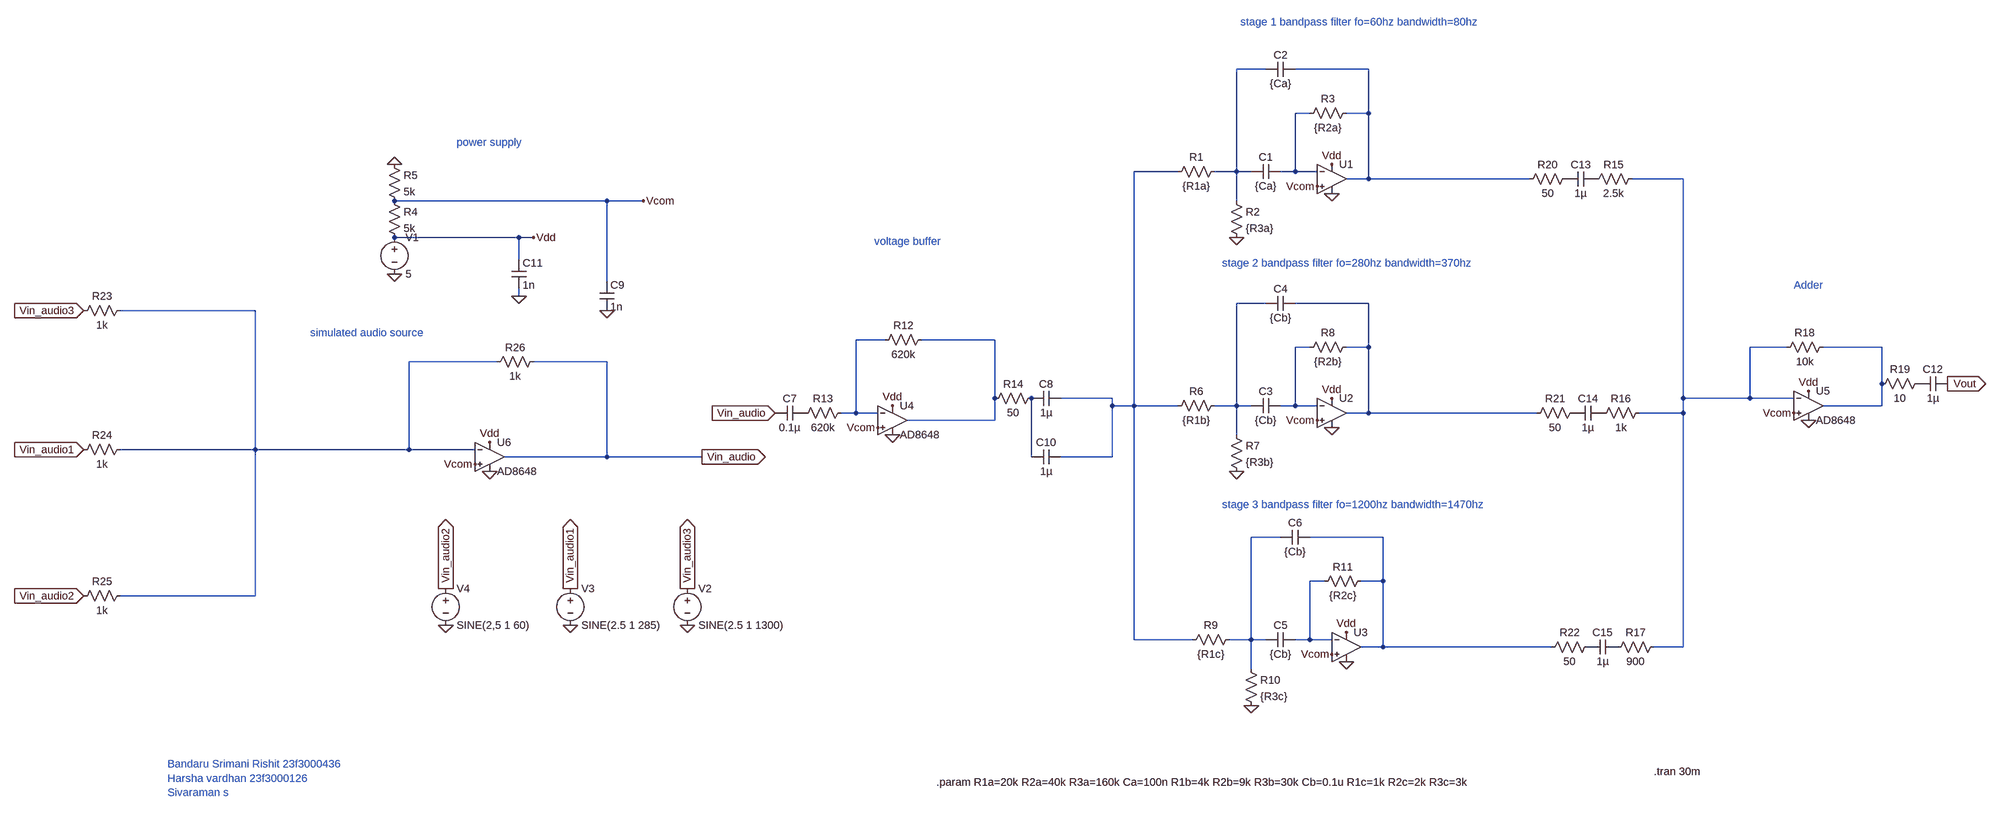
[diagram p0: schematic project_demo.asc]
project_demo.asc, the LTspice schematic file:
Version 4.1
SHEET 1 2216 1440
WIRE 256 -160 192 -160
WIRE 480 -160 320 -160
WIRE 352 -64 320 -64
WIRE 480 -64 480 -160
WIRE 480 -64 432 -64
WIRE 64 64 -32 64
WIRE 192 64 192 -160
WIRE 192 64 144 64
WIRE 224 64 192 64
WIRE 320 64 320 -64
WIRE 320 64 288 64
WIRE 368 64 320 64
WIRE 480 80 480 -64
WIRE 480 80 432 80
WIRE 832 80 480 80
WIRE 1168 80 1056 80
WIRE -1184 128 -1648 128
WIRE -1104 128 -1184 128
WIRE 192 128 192 64
WIRE -1376 208 -1648 208
WIRE -1344 208 -1376 208
WIRE -1376 256 -1376 208
WIRE -1184 304 -1184 128
WIRE -1376 336 -1376 320
WIRE 256 352 192 352
WIRE 480 352 320 352
WIRE -1952 368 -2272 368
WIRE -576 432 -640 432
WIRE -336 432 -496 432
WIRE 352 448 320 448
WIRE 480 448 480 352
WIRE 480 448 432 448
WIRE 1472 448 1392 448
WIRE 1680 448 1552 448
WIRE -1424 480 -1616 480
WIRE -1184 480 -1344 480
WIRE 1680 528 1680 448
WIRE -336 560 -336 432
WIRE -80 560 -192 560
WIRE 1168 560 1168 80
WIRE 1392 560 1392 448
WIRE 1392 560 1168 560
WIRE 1488 560 1392 560
WIRE -80 576 -80 560
WIRE -32 576 -32 64
WIRE -32 576 -80 576
WIRE 64 576 -32 576
WIRE 192 576 192 352
WIRE 192 576 144 576
WIRE 224 576 192 576
WIRE 320 576 320 448
WIRE 320 576 288 576
WIRE 368 576 320 576
WIRE 1680 576 1680 528
WIRE 1680 576 1552 576
WIRE -640 592 -640 432
WIRE -640 592 -672 592
WIRE -592 592 -640 592
WIRE 480 592 480 448
WIRE 480 592 432 592
WIRE 848 592 480 592
WIRE 1168 592 1168 560
WIRE 1168 592 1072 592
WIRE -336 608 -336 560
WIRE -336 608 -528 608
WIRE 192 640 192 576
WIRE -1952 672 -1952 368
WIRE -1952 672 -2272 672
WIRE -1616 672 -1616 480
WIRE -1616 672 -1952 672
WIRE -1472 672 -1616 672
WIRE -1184 688 -1184 480
WIRE -1184 688 -1408 688
WIRE -976 688 -1184 688
WIRE -256 688 -256 560
WIRE -80 688 -80 576
WIRE -80 688 -192 688
WIRE 288 864 224 864
WIRE 512 864 352 864
WIRE 384 960 352 960
WIRE 512 960 512 864
WIRE 512 960 464 960
WIRE -1952 992 -1952 672
WIRE -1952 992 -2272 992
WIRE -32 1088 -32 576
WIRE 96 1088 -32 1088
WIRE 224 1088 224 864
WIRE 224 1088 176 1088
WIRE 256 1088 224 1088
WIRE 352 1088 352 960
WIRE 352 1088 320 1088
WIRE 400 1088 352 1088
WIRE 512 1104 512 960
WIRE 512 1104 464 1104
WIRE 880 1104 512 1104
WIRE 1168 1104 1168 592
WIRE 1168 1104 1104 1104
WIRE 224 1152 224 1088
FLAG 400 112 0
FLAG 192 208 0
FLAG -1648 288 0
FLAG -1648 48 0
FLAG 400 624 0
FLAG 192 720 0
FLAG -1104 128 Vcom
FLAG 368 96 Vcom
FLAG 368 608 Vcom
FLAG -1344 208 Vdd
FLAG 400 560 Vdd
FLAG 400 48 Vdd
FLAG -1008 1056 0
FLAG -1008 976 Vin_audio3
IOPIN -1008 976 Out
FLAG 432 1136 0
FLAG 224 1232 0
FLAG 400 1120 Vcom
FLAG 432 1072 Vdd
FLAG -560 640 0
FLAG -560 576 Vdd
FLAG -592 624 Vcom
FLAG -816 592 Vin_audio
IOPIN -816 592 In
FLAG -1184 368 0
FLAG 1520 544 Vdd
FLAG 1520 608 0
FLAG 1488 592 Vcom
FLAG -1376 336 0
FLAG 1824 528 Vout
IOPIN 1824 528 Out
FLAG -1264 1056 0
FLAG -1536 1056 0
FLAG -1264 976 Vin_audio1
IOPIN -1264 976 Out
FLAG -1536 976 Vin_audio2
IOPIN -1536 976 Out
FLAG -1440 720 0
FLAG -1440 656 Vdd
FLAG -976 688 Vin_audio
IOPIN -976 688 Out
FLAG -2352 368 Vin_audio3
IOPIN -2352 368 In
FLAG -2352 672 Vin_audio1
IOPIN -2352 672 In
FLAG -2352 992 Vin_audio2
IOPIN -2352 992 In
FLAG -1472 704 Vcom
SYMBOL res 160 48 R90
WINDOW 0 0 56 VBottom 2
WINDOW 3 32 56 VTop 2
SYMATTR InstName R1
SYMATTR Value {R1a}
SYMBOL res 176 112 R0
SYMATTR InstName R2
SYMATTR Value {R3a}
SYMBOL cap 224 48 M90
WINDOW 0 0 32 VBottom 2
WINDOW 3 32 32 VTop 2
SYMATTR InstName C1
SYMATTR Value {Ca}
SYMBOL cap 256 -176 M90
WINDOW 0 0 32 VBottom 2
WINDOW 3 32 32 VTop 2
SYMATTR InstName C2
SYMATTR Value {Ca}
SYMBOL res 448 -80 R90
WINDOW 0 0 56 VBottom 2
WINDOW 3 32 56 VTop 2
SYMATTR InstName R3
SYMATTR Value {R2a}
SYMBOL UniversalOpAmp2 400 80 R0
SYMATTR InstName U1
SYMBOL voltage -1648 192 R0
WINDOW 123 0 0 Left 0
WINDOW 39 0 0 Left 0
SYMATTR InstName V1
SYMATTR Value 5
SYMBOL res -1664 112 R0
SYMATTR InstName R4
SYMATTR Value 5k
SYMBOL res -1664 32 R0
SYMATTR InstName R5
SYMATTR Value 5k
SYMBOL res 160 560 R90
WINDOW 0 0 56 VBottom 2
WINDOW 3 32 56 VTop 2
SYMATTR InstName R6
SYMATTR Value {R1b}
SYMBOL res 176 624 R0
SYMATTR InstName R7
SYMATTR Value {R3b}
SYMBOL cap 224 560 M90
WINDOW 0 0 32 VBottom 2
WINDOW 3 32 32 VTop 2
SYMATTR InstName C3
SYMATTR Value {Cb}
SYMBOL cap 256 336 M90
WINDOW 0 0 32 VBottom 2
WINDOW 3 32 32 VTop 2
SYMATTR InstName C4
SYMATTR Value {Cb}
SYMBOL res 448 432 R90
WINDOW 0 0 56 VBottom 2
WINDOW 3 32 56 VTop 2
SYMATTR InstName R8
SYMATTR Value {R2b}
SYMBOL UniversalOpAmp2 400 592 R0
SYMATTR InstName U2
SYMBOL voltage -1008 960 R0
WINDOW 123 24 124 Left 2
WINDOW 39 0 0 Left 0
SYMATTR InstName V2
SYMATTR Value SINE(2.5 1 1300)
SYMBOL res 192 1072 R90
WINDOW 0 0 56 VBottom 2
WINDOW 3 32 56 VTop 2
SYMATTR InstName R9
SYMATTR Value {R1c}
SYMBOL res 208 1136 R0
SYMATTR InstName R10
SYMATTR Value {R3c}
SYMBOL cap 256 1072 M90
WINDOW 0 0 32 VBottom 2
WINDOW 3 32 32 VTop 2
SYMATTR InstName C5
SYMATTR Value {Cb}
SYMBOL cap 288 848 M90
WINDOW 0 0 32 VBottom 2
WINDOW 3 32 32 VTop 2
SYMATTR InstName C6
SYMATTR Value {Cb}
SYMBOL res 480 944 R90
WINDOW 0 0 56 VBottom 2
WINDOW 3 32 56 VTop 2
SYMATTR InstName R11
SYMATTR Value {R2c}
SYMBOL UniversalOpAmp2 432 1104 R0
SYMATTR InstName U3
SYMBOL AD8648 -560 544 R0
SYMATTR InstName U4
SYMBOL res -480 416 R90
WINDOW 0 0 56 VBottom 2
WINDOW 3 32 56 VTop 2
SYMATTR InstName R12
SYMATTR Value 620k
SYMBOL res -656 576 R90
WINDOW 0 0 56 VBottom 2
WINDOW 3 32 56 VTop 2
SYMATTR InstName R13
SYMATTR Value 620k
SYMBOL cap -752 576 R90
WINDOW 0 0 32 VBottom 2
WINDOW 3 32 32 VTop 2
SYMATTR InstName C7
SYMATTR Value 0.1µ
SYMBOL res -240 544 R90
WINDOW 0 0 56 VBottom 2
WINDOW 3 32 56 VTop 2
SYMATTR InstName R14
SYMATTR Value 50
SYMBOL cap -192 544 R90
WINDOW 0 0 32 VBottom 2
WINDOW 3 32 32 VTop 2
SYMATTR InstName C8
SYMATTR Value 1µ
SYMBOL cap -1200 304 R0
SYMATTR InstName C9
SYMATTR Value 1n
SYMBOL cap -192 672 R90
WINDOW 0 0 32 VBottom 2
WINDOW 3 32 32 VTop 2
SYMATTR InstName C10
SYMATTR Value 1µ
SYMBOL cap 976 64 R90
WINDOW 0 0 32 VBottom 2
WINDOW 3 32 32 VTop 2
SYMATTR InstName C13
SYMATTR Value 1µ
SYMBOL cap 992 576 R90
WINDOW 0 0 32 VBottom 2
WINDOW 3 32 32 VTop 2
SYMATTR InstName C14
SYMATTR Value 1µ
SYMBOL cap 1024 1088 R90
WINDOW 0 0 32 VBottom 2
WINDOW 3 32 32 VTop 2
SYMATTR InstName C15
SYMATTR Value 1µ
SYMBOL res 1072 64 R90
WINDOW 0 0 56 VBottom 2
WINDOW 3 32 56 VTop 2
SYMATTR InstName R15
SYMATTR Value 2.5k
SYMBOL res 1088 576 R90
WINDOW 0 0 56 VBottom 2
WINDOW 3 32 56 VTop 2
SYMATTR InstName R16
SYMATTR Value 1k
SYMBOL res 1120 1088 R90
WINDOW 0 0 56 VBottom 2
WINDOW 3 32 56 VTop 2
SYMATTR InstName R17
SYMATTR Value 900
SYMBOL AD8648 1520 512 R0
SYMATTR InstName U5
SYMBOL res 1568 432 R90
WINDOW 0 0 56 VBottom 2
WINDOW 3 32 56 VTop 2
SYMATTR InstName R18
SYMATTR Value 10k
SYMBOL res 1776 512 R90
WINDOW 0 0 56 VBottom 2
WINDOW 3 32 56 VTop 2
SYMATTR InstName R19
SYMATTR Value 10
SYMBOL cap 1824 512 R90
WINDOW 0 0 32 VBottom 2
WINDOW 3 32 32 VTop 2
SYMATTR InstName C12
SYMATTR Value 1µ
SYMBOL res 928 64 R90
WINDOW 0 0 56 VBottom 2
WINDOW 3 32 56 VTop 2
SYMATTR InstName R20
SYMATTR Value 50
SYMBOL res 944 576 R90
WINDOW 0 0 56 VBottom 2
WINDOW 3 32 56 VTop 2
SYMATTR InstName R21
SYMATTR Value 50
SYMBOL res 976 1088 R90
WINDOW 0 0 56 VBottom 2
WINDOW 3 32 56 VTop 2
SYMATTR InstName R22
SYMATTR Value 50
SYMBOL cap -1392 256 R0
SYMATTR InstName C11
SYMATTR Value 1n
SYMBOL voltage -1264 960 R0
WINDOW 123 24 124 Left 2
WINDOW 39 0 0 Left 0
SYMATTR InstName V3
SYMATTR Value SINE(2.5 1 285)
SYMBOL voltage -1536 960 R0
WINDOW 123 24 124 Left 2
WINDOW 39 0 0 Left 0
SYMATTR InstName V4
SYMATTR Value SINE(2,5 1 60)
SYMBOL AD8648 -1440 624 R0
SYMATTR InstName U6
SYMBOL res -2256 352 R90
WINDOW 0 0 56 VBottom 2
WINDOW 3 32 56 VTop 2
SYMATTR InstName R23
SYMATTR Value 1k
SYMBOL res -2256 656 R90
WINDOW 0 0 56 VBottom 2
WINDOW 3 32 56 VTop 2
SYMATTR InstName R24
SYMATTR Value 1k
SYMBOL res -2256 976 R90
WINDOW 0 0 56 VBottom 2
WINDOW 3 32 56 VTop 2
SYMATTR InstName R25
SYMATTR Value 1k
SYMBOL res -1328 464 R90
WINDOW 0 0 56 VBottom 2
WINDOW 3 32 56 VTop 2
SYMATTR InstName R26
SYMATTR Value 1k
TEXT -464 1400 Left 2 !.param R1a=20k R2a=40k R3a=160k Ca=100n R1b=4k R2b=9k R3b=30k Cb=0.1u R1c=1k R2c=2k R3c=3k
TEXT -600 216 Left 2 ;voltage buffer
TEXT 200 -264 Left 2 ;stage 1 bandpass filter fo=60hz bandwidth=80hz
TEXT 160 264 Left 2 ;stage 2 bandpass filter fo=280hz bandwidth=370hz
TEXT 160 792 Left 2 ;stage 3 bandpass filter fo=1200hz bandwidth=1470hz
TEXT 1488 312 Left 2 ;Adder
TEXT 1104 1376 Left 2 !.tran 30m
TEXT -1512 0 Left 2 ;power supply
TEXT -1832 416 Left 2 ;simulated audio source
TEXT -2144 1360 Left 2 ;Bandaru Srimani Rishit 23f3000436\nHarsha vardhan 23f3000126\nSivaraman s

The netlist it stands for:
* project_demo.asc
R1 N001 N004 {R1a}
R2 N001 0 {R3a}
C1 N001 N003 {Ca}
C2 N001 N002 {Ca}
R3 N002 N003 {R2a}
X§U1 Vcom N003 Vdd 0 N002 level2 Avol=1Meg GBW=10Meg Slew=10Meg Ilimit=25m Rail=0 Vos=0 En=0 Enk=0 In=0 Ink=0 Rin=500Meg  ; pins In+ In- V+ V- OUT
V1 Vdd 0 5
R4 Vcom Vdd 5k
R5 0 Vcom 5k
R6 N006 N004 {R1b}
R7 N006 0 {R3b}
C3 N006 N011 {Cb}
C4 N006 N007 {Cb}
R8 N007 N011 {R2b}
X§U2 Vcom N011 Vdd 0 N007 level2 Avol=1Meg GBW=10Meg Slew=10Meg Ilimit=25m Rail=0 Vos=0 En=0 Enk=0 In=0 Ink=0 Rin=500Meg  ; pins In+ In- V+ V- OUT
V2 Vin_audio3 0 SINE(2.5 1 1300)
R9 N014 N004 {R1c}
R10 N014 0 {R3c}
C5 N014 N016 {Cb}
C6 N014 N015 {Cb}
R11 N015 N016 {R2c}
X§U3 Vcom N016 Vdd 0 N015 level2 Avol=1Meg GBW=10Meg Slew=10Meg Ilimit=25m Rail=0 Vos=0 En=0 Enk=0 In=0 Ink=0 Rin=500Meg  ; pins In+ In- V+ V- OUT
X§U4 Vcom N009 Vdd 0 N010 AD8648  ; pins In+ In- V+ V- OUT
R12 N010 N009 620k
R13 N009 P001 620k
C7 P001 Vin_audio 0.1µ
R14 N013 N010 50
C8 N004 N013 1µ
C9 Vcom 0 1n
C10 N004 N013 1µ
C13 P002 P003 1µ
C14 P004 P005 1µ
C15 P006 P007 1µ
R15 N005 P002 2.5k
R16 N005 P004 1k
R17 N005 P006 900
X§U5 Vcom N005 Vdd 0 N012 AD8648  ; pins In+ In- V+ V- OUT
R18 N012 N005 10k
R19 P008 N012 10
C12 Vout P008 1µ
R20 P003 N002 50
R21 P005 N007 50
R22 P007 N015 50
C11 Vdd 0 1n
V3 Vin_audio1 0 SINE(2.5 1 285)
V4 Vin_audio2 0 SINE(2,5 1 60)
X§U6 Vcom N008 Vdd 0 Vin_audio AD8648  ; pins In+ In- V+ V- OUT
R23 N008 Vin_audio3 1k
R24 N008 Vin_audio1 1k
R25 N008 Vin_audio2 1k
R26 Vin_audio N008 1k
.param R1a=20k R2a=40k R3a=160k Ca=100n R1b=4k R2b=9k R3b=30k Cb=0.1u R1c=1k R2c=2k R3c=3k
* voltage buffer
* stage 1 bandpass filter fo=60hz bandwidth=80hz
* stage 2 bandpass filter fo=280hz bandwidth=370hz
* stage 3 bandpass filter fo=1200hz bandwidth=1470hz
* Adder
.tran 30m
* power supply
* simulated audio source
* Bandaru Srimani Rishit 23f3000436
* Harsha vardhan 23f3000126
* Sivaraman s
.lib UniversalOpAmp2.lib
.lib ADI.lib
.backanno
.end